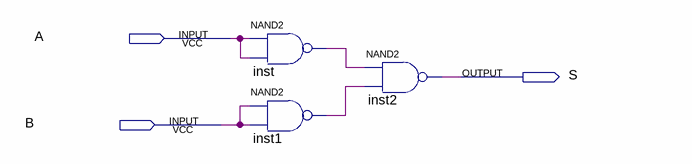
[diagram p0: schematic sheet]
// Quartus schematic nand_or.bdf as structural Verilog: 3 symbols, 3 pins
module nand_or (
  input  A,
  input  B,
  output S
);

  wire inst1_out, inst_out;

  nand inst (inst_out, A, A);
  nand inst1 (inst1_out, B, B);
  nand inst2 (S, inst_out, inst1_out);
endmodule
